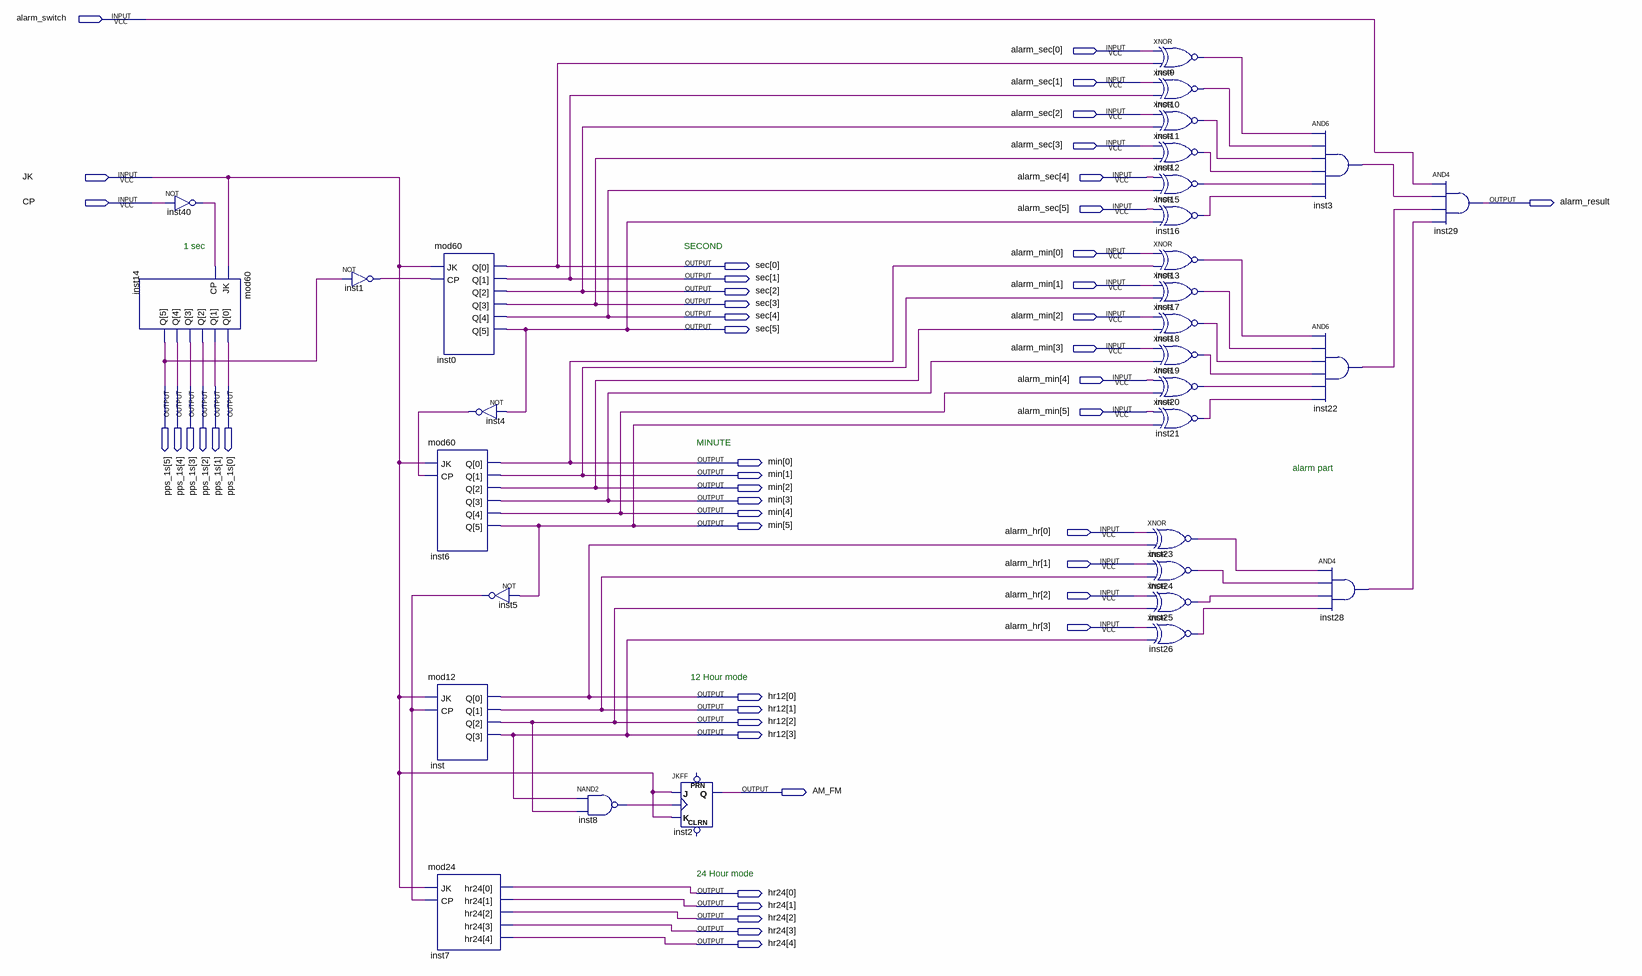
[diagram p0: schematic sheet]
// Quartus schematic digitalClock.bdf as structural Verilog: 31 symbols, 48 pins
module digitalClock (
  input  alarm_switch,
  input  [5:0] alarm_sec,
  input  JK,
  input  CP,
  input  [5:0] alarm_min,
  input  [3:0] alarm_hr,
  output alarm_result,
  output [5:0] sec,
  output [5:0] pps_1s,
  output [5:0] min,
  output [3:0] hr12,
  output AM_FM,
  output [4:0] hr24
);

  wire inst1_out, inst3_out, inst4_out, inst5_out, inst8_out, inst9_out, inst10_out, inst11_out, inst12_out,
       inst13_out, inst15_out, inst16_out, inst17_out, inst18_out, inst19_out, inst20_out, inst21_out,
       inst22_out, inst23_out, inst24_out, inst25_out, inst26_out, inst28_out, inst40_out;

  mod60 inst14 (.JK(JK), .CP(inst40_out), .Q(pps_1s));
  not inst40 (inst40_out, CP);
  not inst1 (inst1_out, pps_1s[5]);
  mod60 inst0 (.JK(JK), .CP(inst1_out), .Q(sec));
  mod60 inst6 (.JK(JK), .CP(inst4_out), .Q(min));
  mod12 inst (.JK(JK), .CP(inst5_out), .Q(hr12));
  mod24 inst7 (.JK(JK), .CP(inst5_out), .hr24(hr24));
  not inst4 (inst4_out, sec[5]);
  not inst5 (inst5_out, min[5]);
  nand inst8 (inst8_out, hr12[3], hr12[2]);
  JKFF inst2 (.K(JK), .J(JK), .CLK(inst8_out), .Q(AM_FM));  // open: PRN, CLRN
  xnor inst9 (inst9_out, alarm_sec[0], sec[0]);
  xnor inst10 (inst10_out, alarm_sec[1], sec[1]);
  xnor inst11 (inst11_out, alarm_sec[2], sec[2]);
  xnor inst12 (inst12_out, alarm_sec[3], sec[3]);
  xnor inst15 (inst15_out, alarm_sec[4], sec[4]);
  xnor inst16 (inst16_out, alarm_sec[5], sec[5]);
  xnor inst13 (inst13_out, alarm_min[0], min[0]);
  xnor inst17 (inst17_out, alarm_min[1], min[1]);
  xnor inst18 (inst18_out, alarm_min[2], min[2]);
  xnor inst19 (inst19_out, alarm_min[3], min[3]);
  xnor inst20 (inst20_out, alarm_min[4], min[4]);
  xnor inst21 (inst21_out, alarm_min[5], min[5]);
  xnor inst23 (inst23_out, alarm_hr[0], hr12[0]);
  xnor inst24 (inst24_out, alarm_hr[1], hr12[1]);
  xnor inst25 (inst25_out, alarm_hr[2], hr12[2]);
  xnor inst26 (inst26_out, alarm_hr[3], hr12[3]);
  and inst3 (inst3_out, inst9_out, inst10_out, inst11_out, inst12_out, inst15_out, inst16_out);
  and inst22 (inst22_out, inst13_out, inst17_out, inst18_out, inst19_out, inst20_out, inst21_out);
  and inst28 (inst28_out, inst23_out, inst24_out, inst25_out, inst26_out);
  and inst29 (alarm_result, alarm_switch, inst3_out, inst22_out, inst28_out);

  // Notes on the sheet:
  //   1 sec
  //   SECOND
  //   MINUTE
  //   alarm part
  //   12 Hour mode
  //   24 Hour mode
endmodule
